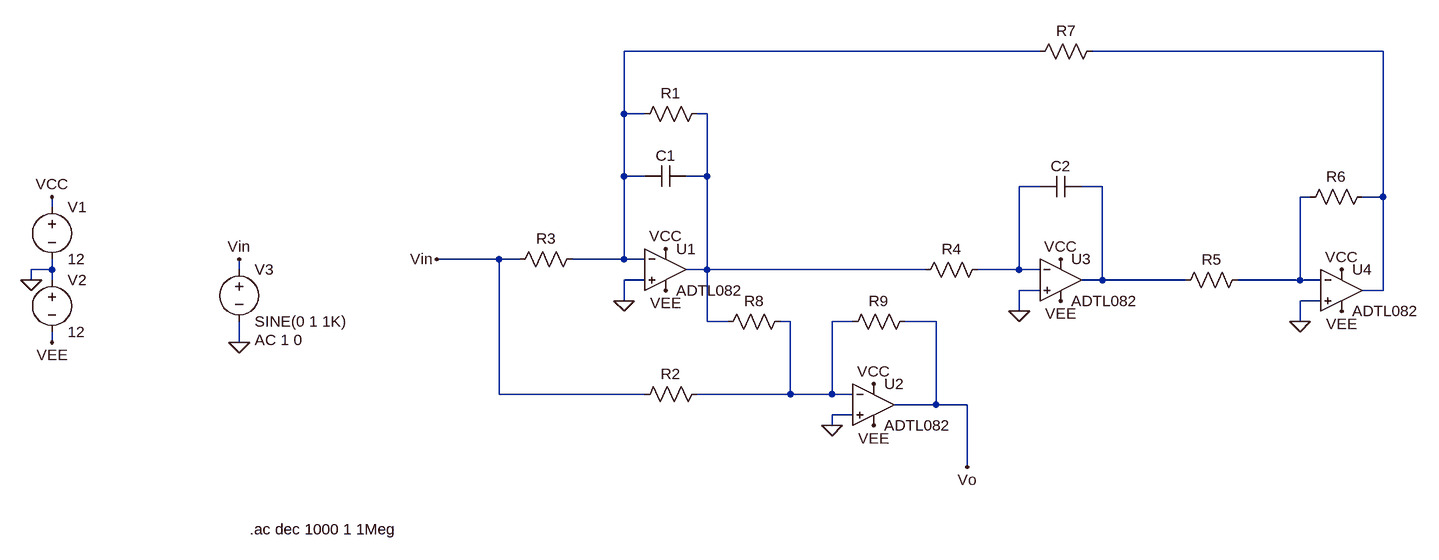
[diagram p0: schematic notch_sinvalores.asc]
notch_sinvalores.asc, the LTspice schematic file:
Version 4.1
SHEET 1 1828 692
WIRE 1136 -192 496 -192
WIRE 1664 -192 1216 -192
WIRE 496 -96 496 -192
WIRE 528 -96 496 -96
WIRE 624 -96 608 -96
WIRE 496 0 496 -96
WIRE 528 0 496 0
WIRE 624 0 624 -96
WIRE 624 0 592 0
WIRE 1136 16 1104 16
WIRE 1232 16 1200 16
WIRE 1552 32 1536 32
WIRE 1664 32 1664 -192
WIRE 1664 32 1632 32
WIRE -384 48 -384 32
WIRE 304 128 208 128
WIRE 336 128 304 128
WIRE 496 128 496 0
WIRE 496 128 416 128
WIRE 528 128 496 128
WIRE -384 144 -384 128
WIRE -384 144 -416 144
WIRE -96 144 -96 128
WIRE 624 144 624 0
WIRE 624 144 592 144
WIRE 960 144 624 144
WIRE 1104 144 1104 16
WIRE 1104 144 1040 144
WIRE 1136 144 1104 144
WIRE -416 160 -416 144
WIRE -384 160 -384 144
WIRE 528 160 496 160
WIRE 1232 160 1232 16
WIRE 1232 160 1200 160
WIRE 1360 160 1232 160
WIRE 1536 160 1536 32
WIRE 1536 160 1440 160
WIRE 1568 160 1536 160
WIRE 1136 176 1104 176
WIRE 1664 176 1664 32
WIRE 1664 176 1632 176
WIRE 496 192 496 160
WIRE 1568 192 1536 192
WIRE 1104 208 1104 176
WIRE 624 224 624 144
WIRE 656 224 624 224
WIRE 752 224 736 224
WIRE 848 224 816 224
WIRE 976 224 928 224
WIRE 1536 224 1536 192
WIRE -384 256 -384 240
WIRE -96 256 -96 224
WIRE 304 336 304 128
WIRE 528 336 304 336
WIRE 752 336 752 224
WIRE 752 336 608 336
WIRE 816 336 816 224
WIRE 816 336 752 336
WIRE 848 336 816 336
WIRE 976 352 976 224
WIRE 976 352 912 352
WIRE 1024 352 976 352
WIRE 848 368 816 368
WIRE 816 384 816 368
WIRE 1024 448 1024 352
FLAG -384 256 VEE
FLAG -384 32 VCC
FLAG -416 160 0
FLAG 496 192 0
FLAG 560 112 VCC
FLAG 560 176 VEE
FLAG 816 384 0
FLAG 880 320 VCC
FLAG 880 384 VEE
FLAG 1104 208 0
FLAG 1168 128 VCC
FLAG 1168 192 VEE
FLAG 1536 224 0
FLAG 1600 144 VCC
FLAG 1600 208 VEE
FLAG 208 128 Vin
FLAG -96 256 0
FLAG -96 128 Vin
FLAG 1024 448 Vo
SYMBOL voltage -384 32 R0
WINDOW 123 0 0 Left 0
WINDOW 39 0 0 Left 0
SYMATTR InstName V1
SYMATTR Value 12
SYMBOL voltage -384 144 R0
WINDOW 123 0 0 Left 0
WINDOW 39 0 0 Left 0
SYMATTR InstName V2
SYMATTR Value 12
SYMBOL cap 592 -16 R90
WINDOW 0 0 32 VBottom 2
WINDOW 3 32 32 VTop 2
SYMATTR InstName C1
SYMATTR Value ""
SYMBOL res 432 112 R90
WINDOW 0 0 56 VBottom 2
WINDOW 3 32 56 VTop 2
SYMATTR InstName R3
SYMATTR Value ""
SYMBOL res 624 -112 R90
WINDOW 0 0 56 VBottom 2
WINDOW 3 32 56 VTop 2
SYMATTR InstName R1
SYMATTR Value ""
SYMBOL res 624 320 R90
WINDOW 0 0 56 VBottom 2
WINDOW 3 32 56 VTop 2
SYMATTR InstName R2
SYMATTR Value ""
SYMBOL res 752 208 R90
WINDOW 0 0 56 VBottom 2
WINDOW 3 32 56 VTop 2
SYMATTR InstName R8
SYMATTR Value ""
SYMBOL cap 1200 0 R90
WINDOW 0 0 32 VBottom 2
WINDOW 3 32 32 VTop 2
SYMATTR InstName C2
SYMATTR Value ""
SYMBOL res 1056 128 R90
WINDOW 0 0 56 VBottom 2
WINDOW 3 32 56 VTop 2
SYMATTR InstName R4
SYMATTR Value ""
SYMBOL res 1456 144 R90
WINDOW 0 0 56 VBottom 2
WINDOW 3 32 56 VTop 2
SYMATTR InstName R5
SYMATTR Value ""
SYMBOL res 1648 16 R90
WINDOW 0 0 56 VBottom 2
WINDOW 3 32 56 VTop 2
SYMATTR InstName R6
SYMATTR Value ""
SYMBOL res 1232 -208 R90
WINDOW 0 0 56 VBottom 2
WINDOW 3 32 56 VTop 2
SYMATTR InstName R7
SYMATTR Value ""
SYMBOL res 944 208 R90
WINDOW 0 0 56 VBottom 2
WINDOW 3 32 56 VTop 2
SYMATTR InstName R9
SYMATTR Value ""
SYMBOL voltage -96 128 R0
WINDOW 123 24 124 Left 2
WINDOW 39 0 0 Left 0
SYMATTR Value2 AC 1 0
SYMATTR InstName V3
SYMATTR Value SINE(0 1 1K)
SYMBOL OpAmps\\ADTL082 560 80 R0
SYMATTR InstName U1
SYMBOL OpAmps\\ADTL082 1168 96 R0
SYMATTR InstName U3
SYMBOL OpAmps\\ADTL082 1600 112 R0
SYMATTR InstName U4
SYMBOL OpAmps\\ADTL082 880 288 R0
SYMATTR InstName U2
TEXT -80 544 Left 2 !.ac dec 1000 1 1Meg

The netlist it stands for:
* notch_sinvalores.asc
V1 VCC 0 12
V2 0 VEE 12
C1 N003 N001
R3 N001 Vin
R1 N003 N001
R2 N007 Vin
R8 N007 N003
C2 N005 N004
R4 N004 N003
R5 N006 N005
R6 N002 N006
R7 N002 N001
R9 Vo N007
V3 Vin 0 SINE(0 1 1K) AC 1 0
X§U1 0 N001 VCC VEE N003 ADTL082  ; pins In+ In- V+ V- OUT
X§U3 0 N004 VCC VEE N005 ADTL082  ; pins In+ In- V+ V- OUT
X§U4 0 N006 VCC VEE N002 ADTL082  ; pins In+ In- V+ V- OUT
X§U2 0 N007 VCC VEE Vo ADTL082  ; pins In+ In- V+ V- OUT
.ac dec 1000 1 1Meg
.lib ADI.lib
.backanno
.end